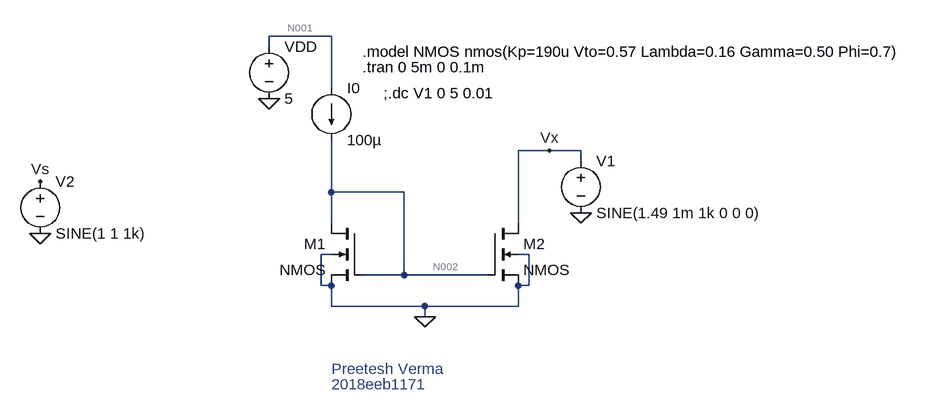
[diagram p0: schematic Basic current mirror.asc]
Basic current mirror.asc, the LTspice schematic file:
Version 4
SHEET 1 1032 680
WIRE 80 64 -16 64
WIRE -16 80 -16 64
WIRE 80 144 80 64
WIRE 416 240 368 240
WIRE 464 240 416 240
WIRE 464 256 464 240
WIRE 80 304 80 224
WIRE 192 304 80 304
WIRE 80 352 80 304
WIRE 368 352 368 240
WIRE 80 400 64 400
WIRE 384 400 368 400
WIRE 192 432 192 304
WIRE 192 432 128 432
WIRE 320 432 192 432
WIRE 64 448 64 400
WIRE 80 448 64 448
WIRE 384 448 384 400
WIRE 384 448 368 448
WIRE 80 480 80 448
WIRE 224 480 80 480
WIRE 368 480 368 448
WIRE 368 480 224 480
WIRE 224 496 224 480
FLAG -16 160 0
FLAG 224 496 0
FLAG 464 336 0
FLAG 416 240 Vx
FLAG -368 368 0
FLAG -368 288 Vs
SYMBOL nmos4 128 352 M0
SYMATTR InstName M1
SYMBOL nmos4 320 352 R0
SYMATTR InstName M2
SYMBOL current 80 144 R0
WINDOW 123 0 0 Left 0
WINDOW 39 0 0 Left 0
SYMATTR InstName I0
SYMATTR Value 100µ
SYMBOL voltage -16 64 R0
WINDOW 123 0 0 Left 0
WINDOW 39 0 0 Left 0
SYMATTR InstName VDD
SYMATTR Value 5
SYMBOL voltage 464 240 R0
WINDOW 123 0 0 Left 0
WINDOW 39 0 0 Left 0
SYMATTR InstName V1
SYMATTR Value SINE(1.49 1m 1k 0 0 0)
SYMBOL voltage -368 272 R0
WINDOW 123 0 0 Left 0
WINDOW 39 0 0 Left 0
SYMATTR InstName V2
SYMATTR Value SINE(1 1 1k)
TEXT 128 88 Left 2 !.model NMOS nmos(Kp=190u Vto=0.57 Lambda=0.16 Gamma=0.50 Phi=0.7)
TEXT 128 112 Left 2 !.tran 0 5m 0 0.1m
TEXT 80 576 Left 2 ;Preetesh Verma
TEXT 80 600 Left 2 ;2018eeb1171
TEXT 160 152 Left 2 !;.dc V1 0 5 0.01

The netlist it stands for:
* Basic current mirror.asc
M1 N002 N002 0 0 NMOS
M2 Vx N002 0 0 NMOS
I0 N001 N002 100µ
VDD N001 0 5
V1 Vx 0 SINE(1.49 1m 1k 0 0 0)
V2 Vs 0 SINE(1 1 1k)
.model NMOS NMOS
.model PMOS PMOS
.lib standard.mos
.model NMOS nmos(Kp=190u Vto=0.57 Lambda=0.16 Gamma=0.50 Phi=0.7)
.tran 0 5m 0 0.1m
* Preetesh Verma
* 2018eeb1171
;.dc V1 0 5 0.01
.backanno
.end

* Results of the author's LTspice run, read from the files saved beside the schematic
* Operating Point, zero values left out:
*   V(n002) = 1.492 V
*   V(vx) = 1.49 V
*   V(n001) = 5 V
*   V(vs) = 1 V
*   Id(M2) = 99.98 µA
*   Ib(M2) = -1.5 pA
*   Is(M2) = -99.98 µA
*   Id(M1) = 100 µA
*   Ib(M1) = -1.502 pA
*   Is(M1) = -100 µA
*   I(I0) = 100 µA
*   I(V1) = -99.98 µA
*   I(Vdd) = -100 µA
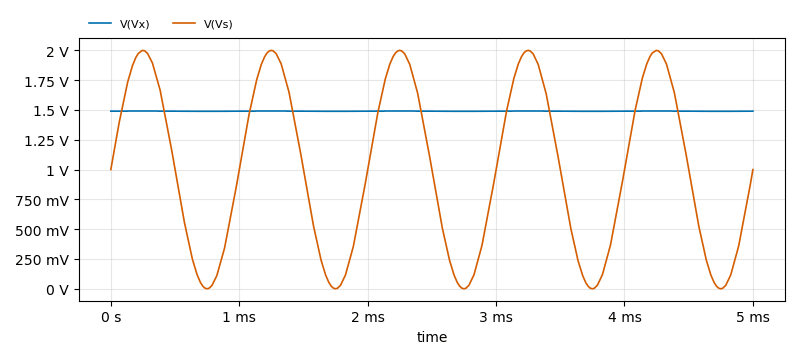
[diagram p1: Transient Analysis of Basic current mirror.asc, plotted from the saved traces]
* Transient Analysis, 1 run:
*   V(Vx): min 1.489 V, max 1.491 V, average 1.49 V, rms 1.49 V, last 1.49 V
*   V(Vs): min 3.264 µV, max 2 V, average 1 V, rms 1.231 V, last 1 V